# EAGLE design server-v1 (EAGLE 6.4)
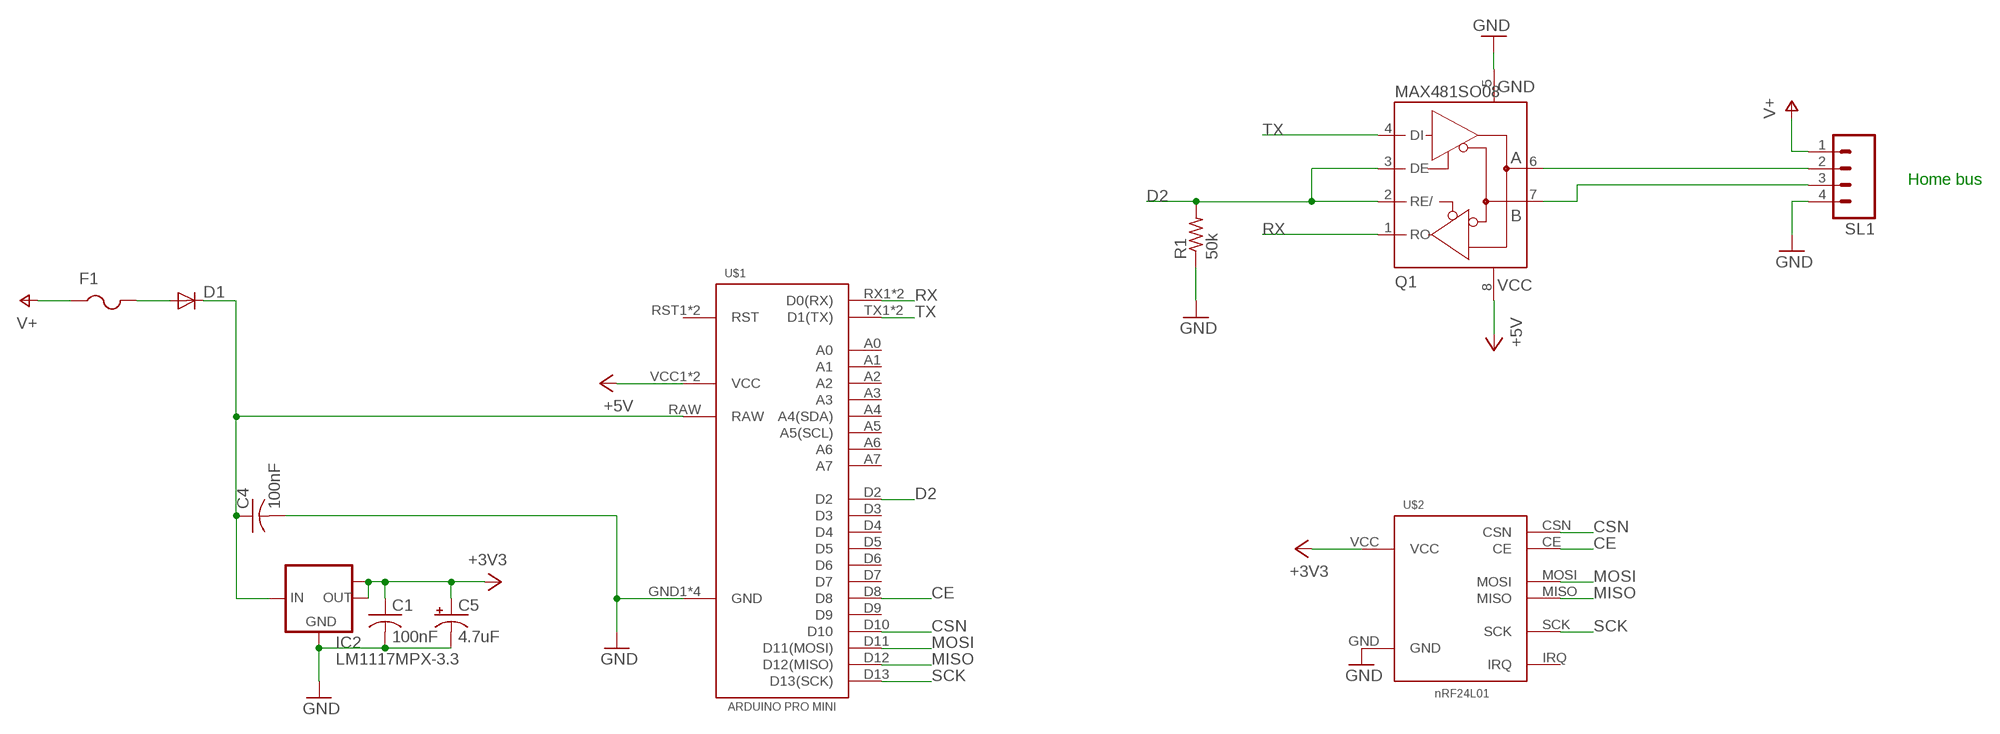
[diagram p0: schematic, sheet 1]

## Parts
C1  100nF  C-USC0603K  [C0603K]
C4  100nF  C-USC0603K  [C0603K]
C5  4.7uF  CPOL-USE1.8-4  [E1,8-4]
D1  DIODE-MICROMELF-W  [MICROMELF-W]
F1  PTCFUSE-1812  [1812]
IC2  LM1117MPX-3.3  [SOT223]
Q1  MAX481SO08  [SO08]
R1  50k  R-US_R0603  [R0603]
SL1  M04  [04P]
U$1  ARDUINO-PRO-MINI  [ARDUINO-PRO-MINI]
U$2  NRF24L01MODULE  [NRF24L01-MODULE]

## Nets
+3V3: C1.1 C5.+ IC2.2(OUT) IC2.TAB(OUT1) U$2.VCC
+5V: Q1.8(+5V) U$1.VCC1(VCC) U$1.VCC2(VCC)
+12V: C4.1 D1.C IC2.3(IN) U$1.RAW
CE: U$1.D8 U$2.CE
CSN: U$1.D10 U$2.CSN
D2: Q1.2(RE/) Q1.3(DE) R1.2 U$1.D2
GND: C1.2 C4.2 C5.- IC2.1(GND) Q1.5(GND) R1.1 SL1.4 U$1.GND1(GND) U$1.GND2(GND) U$1.GND3(GND) U$1.GND4(GND) U$2.GND
MISO: U$1.D12(D12(MISO)) U$2.MISO
MOSI: U$1.D11(D11(MOSI)) U$2.MOSI
N$1: D1.A F1.2
N$2: Q1.6(A) SL1.2
N$5: Q1.7(B) SL1.3
RX: Q1.1(RO) U$1.RX1(D0(RX)) U$1.RX2(D0(RX))
SCK: U$1.D13(D13(SCK)) U$2.SCK
TX: Q1.4(DI) U$1.TX1(D1(TX)) U$1.TX2(D1(TX))
V+: F1.1 SL1.1
Unconnected: U$1.A0 U$1.A1 U$1.A2 U$1.A3 U$1.A4(A4(SDA)) U$1.A5(A5(SCL)) U$1.A6 U$1.A7 U$1.D3 U$1.D4 U$1.D5 U$1.D6 U$1.D7 U$1.D9 U$1.RST1(RST) U$1.RST2(RST) U$2.IRQ

## Notes on the sheet
- Home bus

## Library data of the parts
C1 C4 = adafruit:C-US: CAPACITOR, American symbol
C5 = adafruit:CPOL-US: POLARIZED CAPACITOR, American symbol
D1 = diode:DIODE-: DIODE
F1 = adafruit:PTCFUSE: PTC fuses, resettable thermistors
IC2 = lm1117:LM1117MPX-*
Q1 = serge:MAX481
R1 = adafruit:R-US_: RESISTOR, American symbol
SL1 = con-amp-quick:M04: AMP QUICK CONNECTOR; OC_FARNELL: unknown; OC_NEWARK: unknown
U$1 = serge:ARDUINO-PRO-MINI
U$2 = serge:NRF24L01

## Board
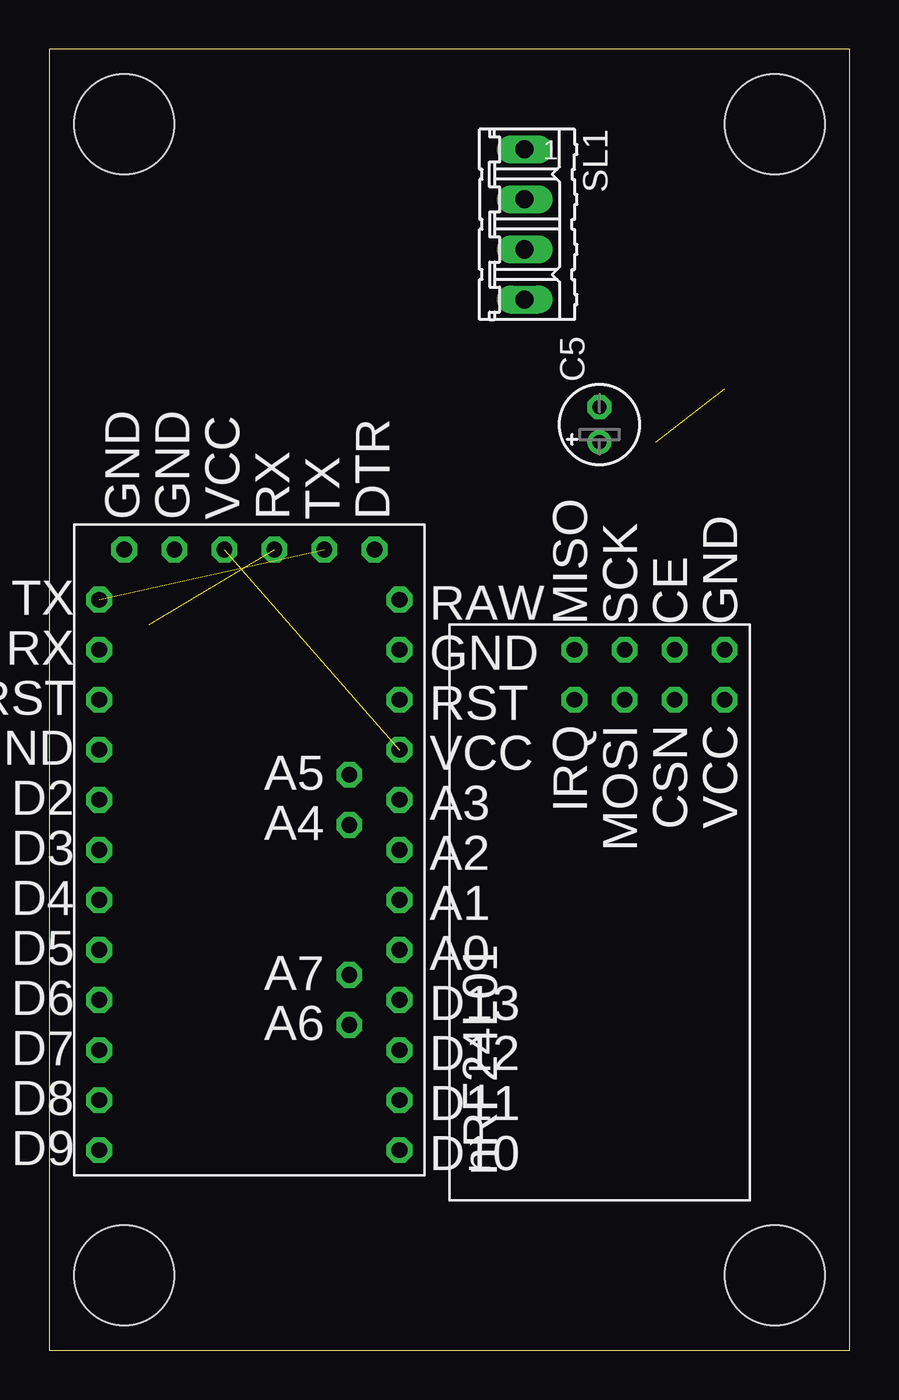
[diagram p1: board, top side]
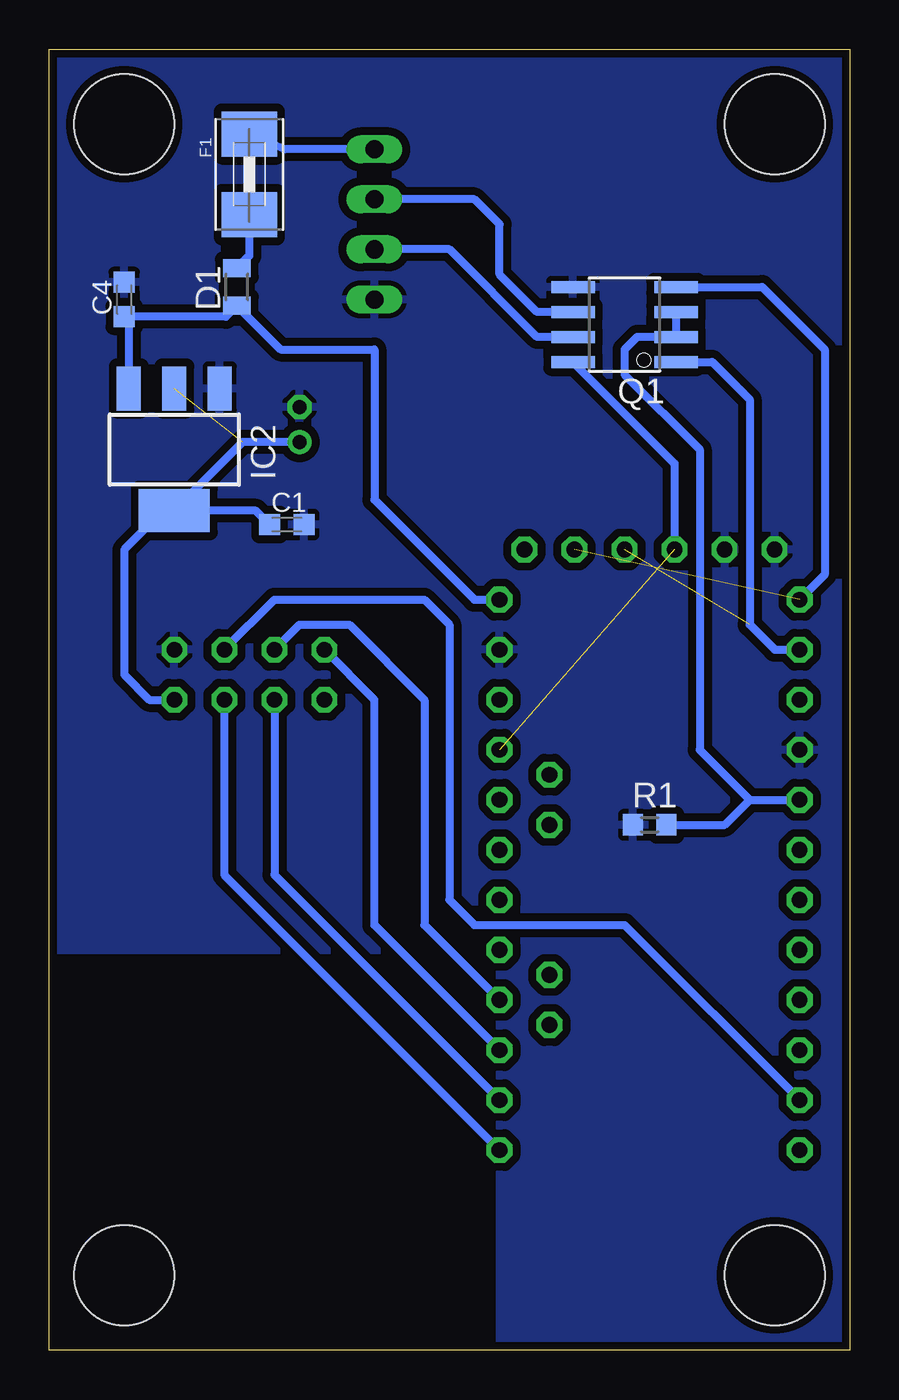
[diagram p2: board, bottom side, seen from below]

Size 40.64 x 66.04 mm. Coordinates in mm from the lower left corner, seen from the top.
Outline: 0,0 40.64,0 40.64,66.04 0,66.04 0,0
Copper layers (1*16): Top 0.035mm / dielectric 1.5mm / Bottom 0.035mm
Design rules "default": minimum track width 10mil, minimum drill 24mil, track to track 16mil, track to pad 16mil, pad to pad 16mil, via to via 16mil, smd to smd 16mil, copper to edge 16mil, drill to drill 8mil, minimum pad ring 10mil, minimum via ring 8mil, stop-mask expansion 4mil, vias tented up to drill 0mil, thermal gap 10mil
Holes 5.08 mm at 3.81,3.81 36.83,3.81 3.81,62.23 36.83,62.23

### Footprints (pad centres in the part's own frame; a part is rotated, then mirrored left to right if it is on the bottom)
C0603K = smd 1.05 x 1.08: 1 -0.875,0; 2 0.875,0
E1,8-4 = drill 0.711 pad 1.168: + -0.889,0 | drill 0.711 pad 1.168 octagon: - 0.889,0
MICROMELF-W = smd 0.9 x 1.4: A 0.95,0; C -0.95,0
1812 = smd 2.286 x 2.794: 1 -2.046,0; 2 2.046,0
SOT223 = smd 1.219 x 2.235: 1 -2.311,-3.099; 2 0,-3.099; 3 2.311,-3.099 | smd 3.6 x 2.2: TAB 0,3.099
SO08 = smd 0.61 x 2.21: 1 -1.905,-2.616; 2 -0.635,-2.616; 3 0.635,-2.616; 4 1.905,-2.616; 5 1.905,2.616; 6 0.635,2.616; 7 -0.635,2.616; 8 -1.905,2.616
R0603 = smd 1 x 1.1: 1 -0.85,0; 2 0.85,0
04P = drill 0.914 long: 1 -3.81,0; 2 -1.27,0; 3 1.27,0; 4 3.81,0
ARDUINO-PRO-MINI = drill 0.8 octagon: A0 -3.81,-7.62; A1 -1.27,-7.62; A2 1.27,-7.62; A3 3.81,-7.62; A4 2.54,-5.08; A5 5.08,-5.08; A6 -7.62,-5.08; A7 -5.08,-5.08; D2 3.81,7.62; D3 1.27,7.62; D4 -1.27,7.62; D5 -3.81,7.62; D6 -6.35,7.62; D7 -8.89,7.62; D8 -11.43,7.62; D9 -13.97,7.62; D10 -13.97,-7.62; D11 -11.43,-7.62; D12 -8.89,-7.62; D13 -6.35,-7.62; DTR 16.51,-6.35; GND1 11.43,-7.62; GND2 16.51,6.35; GND3 16.51,3.81; GND4 6.35,7.62; RAW 13.97,-7.62; RST1 8.89,7.62; RST2 8.89,-7.62; RX1 11.43,7.62; RX2 16.51,-1.27; TX1 13.97,7.62; TX2 16.51,-3.81; VCC1 16.51,1.27; VCC2 6.35,-7.62
NRF24L01-MODULE = drill 0.8 octagon: CE 10.16,-2.54; CSN 7.62,-2.54; GND 10.16,-5.08; IRQ 7.62,2.54; MISO 10.16,2.54; MOSI 7.62,0; SCK 10.16,0; VCC 7.62,-5.08

### Placement (x,y rotation side)
C1  28.57,41.91 0 bottom
C4  36.83,53.34 90 bottom
C5  27.94,46.99 90 top
D1  31.11,53.98 90 bottom
F1  30.48,59.69 270 bottom
IC2  34.29,45.72 180 bottom
Q1  11.43,52.07 90 bottom
R1  10.16,26.67 0 bottom
SL1  24.13,57.15 270 top
U$1  10.16,24.13 90 top
U$2  29.21,25.4 90 top

### Tracks (layer width: path | path; a pad name or v marks a point on that pad's centre or on a via)
+3V3  (1 unrouted)
  Bottom 0.406: C5.+ 30.81,46.1 IC2.TAB | IC2.TAB 34.85,42.62 36.83,40.64 36.83,34.29 35.56,33.02 U$2.VCC | C1.1 30.16,42.62 IC2.TAB
+5V  (1 unrouted)
  Bottom 0.406: Q1.8 8.89,45.01 U$1.VCC1
+12V
  Bottom 0.406: IC2.3 36.6,52.24 C4.1 31.68,52.47 D1.C 28.89,50.8 24.13,50.8 24.13,43.18 19.05,38.1 U$1.RAW
CE
  Bottom 0.406: U$2.CE 29.21,38.1 21.59,38.1 20.32,36.83 20.32,22.86 19.05,21.59 11.43,21.59 U$1.D8
CSN
  Bottom 0.406: U$2.CSN 31.75,24.13 U$1.D10
D2
  Bottom 0.406: Q1.3 Q1.2 10.79,51.44 11.43,50.8 11.43,49.53 7.62,45.72 7.62,30.48 5.08,27.94 | 5.08,27.94 U$1.D2 | R1.2 6.35,26.67 5.08,27.94
GND
  pour Bottom: 0,66.04 40.64,66.04 40.64,20.32 17.78,20.32 17.78,0 0,0
MISO
  Bottom 0.406: U$1.D12 24.13,21.59 24.13,33.02 U$2.MISO
MOSI
  Bottom 0.406: U$2.MOSI 29.21,24.13 U$1.D11
N$1
  Bottom 0.406: F1.2 30.48,55.56 D1.A
N$2
  Bottom 0.406: Q1.6 15.88,52.7 17.78,54.61 17.78,57.15 19.05,58.42 SL1.2
N$5
  Bottom 0.406: Q1.7 15.88,51.44 20.32,55.88 SL1.3
RX  (1 unrouted)
  Bottom 0.406: Q1.1 6.99,50.16 5.08,48.26 5.08,36.83 3.81,35.56 U$1.RX1
SCK
  Bottom 0.406: U$2.SCK 27.94,36.83 25.4,36.83 21.59,33.02 21.59,21.59 U$1.D13
TX  (1 unrouted)
  Bottom 0.406: Q1.4 4.45,53.98 1.27,50.8 1.27,39.37 U$1.TX1
V+
  Bottom 0.406: SL1.1 28.72,60.96 F1.1